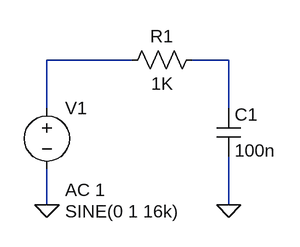
[diagram p0: schematic EP-2 img2 .asc]
EP-2 img2 .asc, the LTspice schematic file:
Version 4
SHEET 1 880 680
WIRE 192 -32 80 -32
WIRE 320 -32 272 -32
WIRE 80 32 80 -32
WIRE 320 32 320 -32
WIRE 80 160 80 112
WIRE 320 160 320 96
FLAG 80 160 0
FLAG 320 160 0
SYMBOL voltage 80 16 R0
WINDOW 3 24 152 Left 2
WINDOW 123 24 124 Left 2
WINDOW 39 0 0 Left 0
SYMATTR InstName V1
SYMATTR Value SINE(0 1 16k)
SYMATTR Value2 AC 1
SYMBOL res 288 -48 R90
WINDOW 0 0 56 VBottom 2
WINDOW 3 32 56 VTop 2
SYMATTR InstName R1
SYMATTR Value 1K
SYMBOL cap 304 32 R0
SYMATTR InstName C1
SYMATTR Value 100n

The netlist it stands for:
* EP-2 img2 .asc
V1 N001 0 SINE(0 1 16k) AC 1
R1 N002 N001 1K
C1 N002 0 100n
.backanno
.end